# Altium project openEPS.PrjPcb (part 2 of 5)

## Sheet INA381A Overcurrent Protection.SchDoc: INA381A Overcurrent Protection
size Letter; SheetNumber: 21
Used 2 times, as channels U_INA381A Overcurrent Protection2, U_INA381A Overcurrent Protection1. Parts and nets are listed once, with the designators drawn on the sheet.
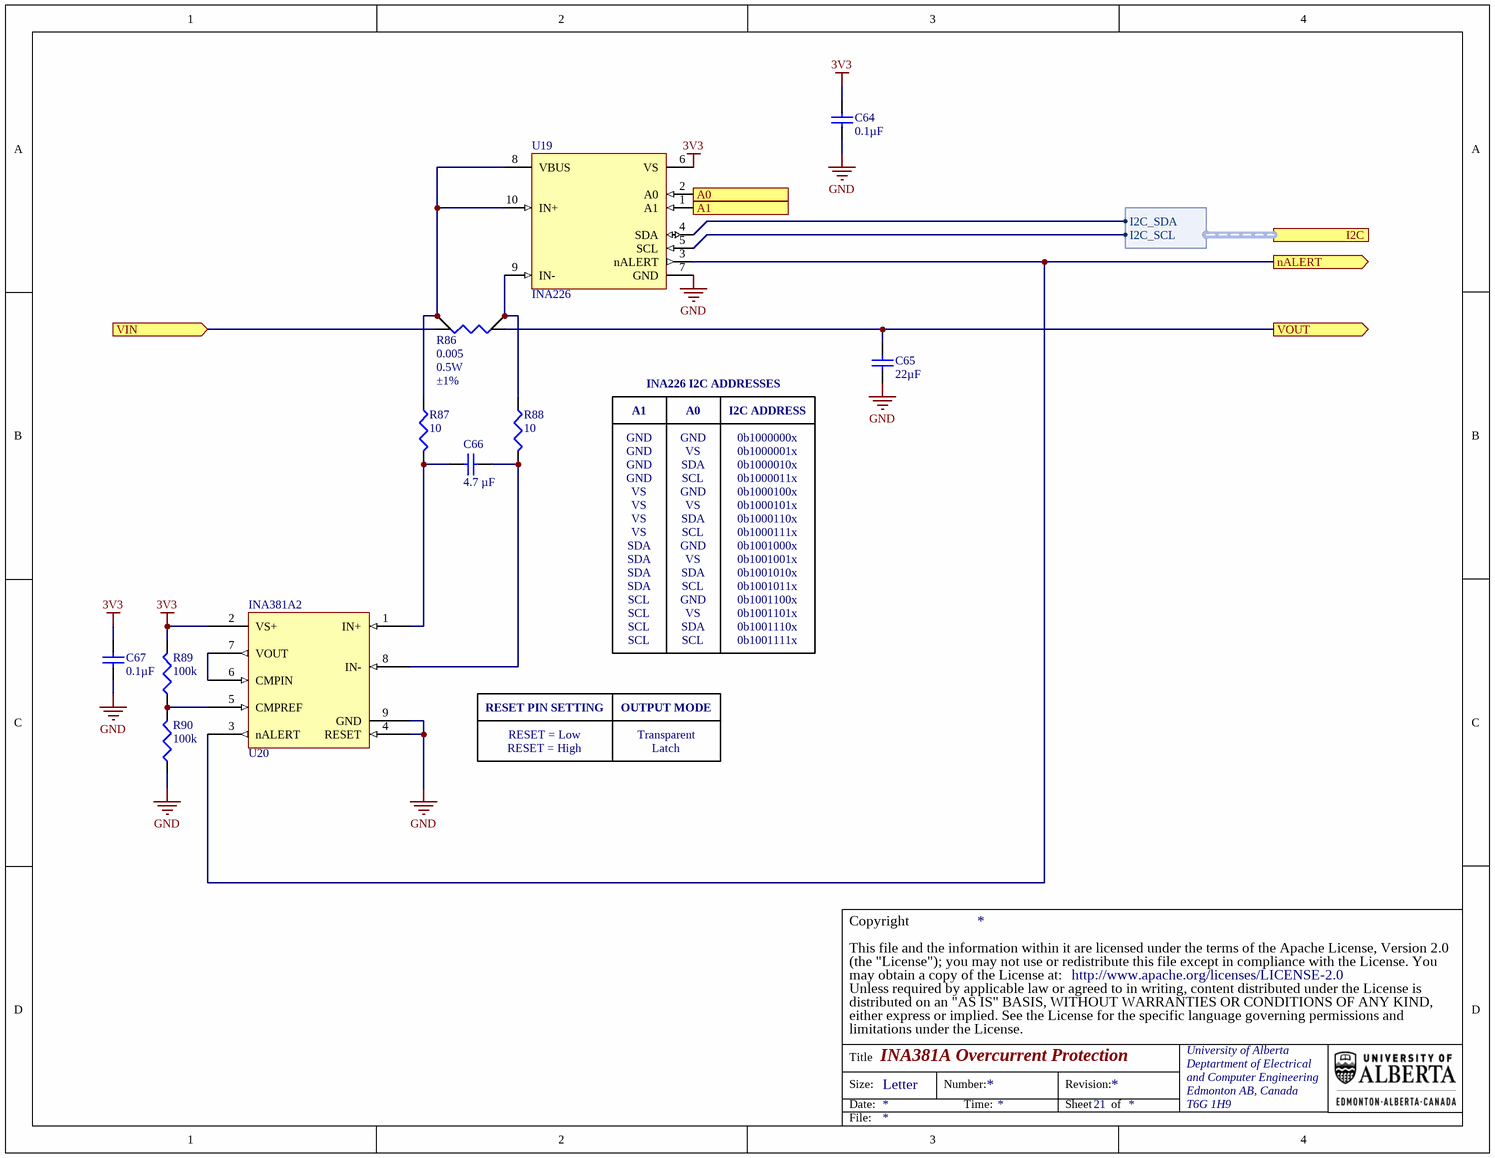
[diagram p5: INA381A Overcurrent Protection.SchDoc]

### Parts
C64  value 0.1µF  [TDK-CGA2B]  (hidden comment: Cap)
C65  value 22µF  [TY-1206L]  (hidden comment: Cap)
C66  value 4.7 µF  [MUR-GRM188]  (hidden comment: Cap)
C67  value 0.1µF  [TDK-CGA2B]  (hidden comment: Cap)
R86  value 0.005  Power - Rated: 0.5W  Tolerance: ±1%  [BRN-CRF0805]  (hidden comment: Res Sense)
R87  value 10  [PANA-ERA2A]  (hidden comment: Res3)
R88  value 10  [PANA-ERA2A]  (hidden comment: Res3)
R89  value 100k  [PANA-ERJ2R]  (hidden comment: Res3)
R90  value 100k  [PANA-ERJ2R]  (hidden comment: Res3)
U19  INA226  [TI-DGS]
U20  INA381A2  [TI-DSG0008A]

### Ports
A0 (in), A1 (in), I2C (harness INA226_I2C), nALERT (out), VIN (in), VOUT (out)

### Harnesses
INA226_I2C: I2C_SCL, I2C_SDA

### Nets
3V3: C64.2 C67.2 R89.2 U19.6(VS) U20.2(VS+)
GND: C64.1 C65.1 C67.1 R90.1 U19.7(GND) U20.4(RESET) U20.9(GND)
A0: U19.2(A0) ; port A0
A1: U19.1(A1) ; port A1
nALERT: U19.3(nALERT) U20.3(nALERT) ; port nALERT
VIN: R86.2(I2) ; port VIN
VOUT: C65.2 R86.1(I1) ; port VOUT
NetC66_1: C66.1 R88.2 U20.8(IN-)
NetC66_2: C66.2 R87.2 U20.1(IN+)
NetR86_3: R86.3(S2) R87.1 U19.8(VBUS) U19.10(IN+)
NetR86_4: R86.4(S1) R88.1 U19.9(IN-)
NetR89_1: R89.1 R90.2 U20.5(CMPREF)
NetU19_4: U19.4(SDA) ; port I2C.I2C_SDA
NetU19_5: U19.5(SCL) ; port I2C.I2C_SCL
NetU20_6: U20.6(CMPIN) U20.7(VOUT)

### Channels
U_INA381A Overcurrent Protection2: designators end in _1; ports A0=3V3 A1=3V3 nALERT=NetR52_1 VIN=1V2IN VOUT=1V2
U_INA381A Overcurrent Protection1: designators end in _2; ports A0=I2C0.I2C_SDA A1=3V3 nALERT=NetR52_1 VIN=3V3IN VOUT=3V3

### Notes on the sheet
- A1
- GND
- A0
- INA226 I2C ADDRESSES
- I2C ADDRESS
- 0b1000000x
- VS
- SDA
- SCL
- 0b1000001x
- 0b1000010x
- 0b1000011x
- 0b1000100x
- 0b1000101x
- 0b1000110x
- 0b1000111x
- 0b1001000x
- 0b1001001x
- 0b1001010x
- 0b1001011x
- 0b1001100x
- 0b1001101x
- 0b1001110x
- 0b1001111x
- RESET PIN SETTING
- OUTPUT MODE
- RESET = Low
- RESET = High
- Transparent
- Latch
- (the "License"); you may not use or redistribute this file except in compliance with the License. You
- This file and the information within it are licensed under the terms of the Apache License, Version 2.0
- Copyright
- Unless required by applicable law or agreed to in writing, content distributed under the License is
- distributed on an "AS IS" BASIS, WITHOUT WARRANTIES OR CONDITIONS OF ANY KIND,
- either express or implied. See the License for the specific language governing permissions and
- limitations under the License.
- may obtain a copy of the License at:
- http://www.apache.org/licenses/LICENSE-2.0
- Title
- Size:
- Date:
- Letter
- Number:
- Time:
- Revision:
- Sheet
- of
- University of Alberta
- Deptartment of Electrical
- and Computer Engineering
- Edmonton AB, Canada
- T6G 1H9
- File:

### Library data of the parts
C64 C67 = PC-TDK-02259: CAP CER 0.1UF 50V X7R 0402; Manufacturer Part Number: CGA2B3X7R1H104K050BB; Index: 2259; Designator: C?; Tolerance: ±10%; Published: 2016-03-16; LatestRevisionDate: 2016-03-16; LatestRevisionNote: ...; PackageReference: 0402 (1005 Metric); Publisher: AlbertaSat; PackageDescription: Radial Cap, Thru-Hole; 2 Leads; 0.3 in Pin Spacing; Part Number: PC-TDK-02259; Supplier Part Number 1: 445-6899-1-ND; Supplier 1: Digi-key; Supplier Link: http://www.digikey.ca/product-search/en?keywords=445-6899-1-ND; Voltage - Rated: 50V; Temperature Coefficient: X7R; Applications: Automotive; Operating Temperature: -55°C ~ 125°C
C65 = PC-TY-00721: CAP CER 22UF 16V X7R 1206; Manufacturer Part Number: EMK316BB7226ML-T; Index: 721; Designator: C?; Tolerance: ±20%; Published: 2016-03-13; LatestRevisionDate: 2016-03-13; LatestRevisionNote: ...; PackageReference: 1206 (3216 Metric); Publisher: AlbertaSat; PackageDescription: Chip Capacitor, 2-Leads, Body 3.20x1.60mm, IPC Low Density; Part Number: PC-TY-00721; Supplier Part Number 1: 587-4319-1-ND; Supplier 1: Digi-key; Supplier Link: http://www.digikey.ca/product-search/en?keywords=587-4319-1-ND; Voltage-Rated: 16V; Temperature Coefficient: X7R; Application: General Purpose; Operating Temperature: -55°C ~ 125°C
C66 = 10165: as C4 on sheet openEPS; Published: 8-Jun-2000; LatestRevisionDate: 17-Jul-2002; LatestRevisionNote: Re-released for DXP Platform.; PackageReference: 0603 (1608 Metric); Publisher: Altium Limited; PackageDescription: Chip Capacitor, 2-Leads, Body 1.60x0.80mm, IPC Low Density; Supplier Part Number 1: 490-GRM188Z71C475KE21DCT-ND; Supplier 1: Digi-Key; Supplier Link: #https://www.digikey.ca/en/products/detail/murata-electronics/GRM188Z71C475KE21D/13401930#; Temperature Coefficient: X7R; Application: General Purpose; Operating Temperature: -55°C ~ 125°C; Supplier 2: Mouser; Supplier Part Number 2: 81-GRM188Z71C475KE1D
R86 = PR-BRN-00023: RES 0.005 OHM 1% 1/2W 0805; Manufacturer Part Number: CRF0805-FZ-R005ELF; Index: 23; Designator: R?; Temperature Coefficient: ±50ppm/°C; Part Number: PR-BRN-00023; Supplier Part Number 1: CRF0805-FZ-R005ELFCT-ND; Supplier 1: Digi-key; Supplier Part Number 2: 652-CRF0805FZR005ELF; Supplier 2: Mouser; Publisher: AlbertaSat; Published: 2022-11-26; LatestRevisionDate: 2023-05-04; LatestRevisionNote: Added operating temperature; PackageReference: BRN-CRF0805; Supplier Link: #https://www.digikey.ca/en/products/detail/bourns-inc/CRF0805-FZ-R005ELF/6210977#; Operating Temperature: -55°C ~ 170°C
R87 R88 = 13235: RES SMD 10 OHM 0.5% 1/16W 0402; Part Number: 13235; Manufacturer Part Number: ERA-2AKD100X; Designator: R?; Power: 0.063W, 1/16W; Temperature Coefficient: ±100ppm/°C; Published: 8-Jun-2000; LatestRevisionDate: 29-May-2009; LatestRevisionNote: IPC-7351 Footprint Added.; PackageReference: 0402 (1005 Metric); Publisher: Altium Limited; PackageDescription: Chip Resistor, 2-Leads, Body 1.00x0.50mm, IPC Low Density; Supplier Part Number 1: P10DDCT-ND; Supplier 1: Digi-Key; Supplier Link: http://www.digikey.ca/product-search/en?keywords=P10DDCT-ND; Tolerance: ±0.5%; Operating Temperature: -55°C ~ 155°C
R89 R90 = 18739: RES SMD 100K OHM 1% 1/10W 0402; Part Number: 18739; Manufacturer Part Number: ERJ-2RKF1003X; Designator: R?; Power: 0.1W, 1/10W; Temperature Coefficient: ±100ppm/°C; Published: 8-Jun-2000; LatestRevisionDate: 29-May-2009; LatestRevisionNote: IPC-7351 Footprint Added.; PackageReference: 0402 (1005 Metric); Publisher: Altium Limited; PackageDescription: Chip Resistor, 2-Leads, Body 1.00x0.50mm, IPC Low Density; Supplier Part Number 1: P100KLCT-ND; Supplier 1: Digi-Key; Supplier Link: http://www.digikey.ca/product-search/en?keywords=P100KLCT-ND; Tolerance: ±1%; Operating Temperature: -55°C ~ 155°C
U19 = 19: IC MONITOR PWR/CURR BIDIR 10MSOP; Part Number: 19; Manufacturer Part Number: INA226AQDGSRQ1; Designator: U?; Supplier Part Number 2: 595-INA226AQDGSRQ1; Supplier 2: Mouser; Supplier Part Number 1: 296-42503-1-ND; Supplier 1: Digi-Key; Supplier Link: #https://www.digikey.com/product-detail/en/texas-instruments/INA226AQDGSRQ1/296-42503-1-ND/5416001#; PackageReference: TI-MSOP10; Operating Temperature: -40°C ~ 125°C
U20 = 110: CURRENT SENSE AMPLIFIER WITH INT; Part Number: 110; Manufacturer Part Number: INA381A2IDSGT; Designator: U?; Supplier Part Number 2: 595-INA381A2IDSGT; Supplier 2: Mouser; Supplier Part Number 1: 296-49078-1-ND; Supplier 1: Digi-Key; Supplier Link: #https://www.digikey.ca/product-detail/en/texas-instruments/INA381A2IDSGT/296-49078-1-ND/9091891#; PackageReference: 8-WFDFN Exposed Pad; Operating Temperature: -40°C ~ 125°C (TA)

## Sheet EPS Stack Header.SchDoc: EPS stack header
size Letter; SheetNumber: 20
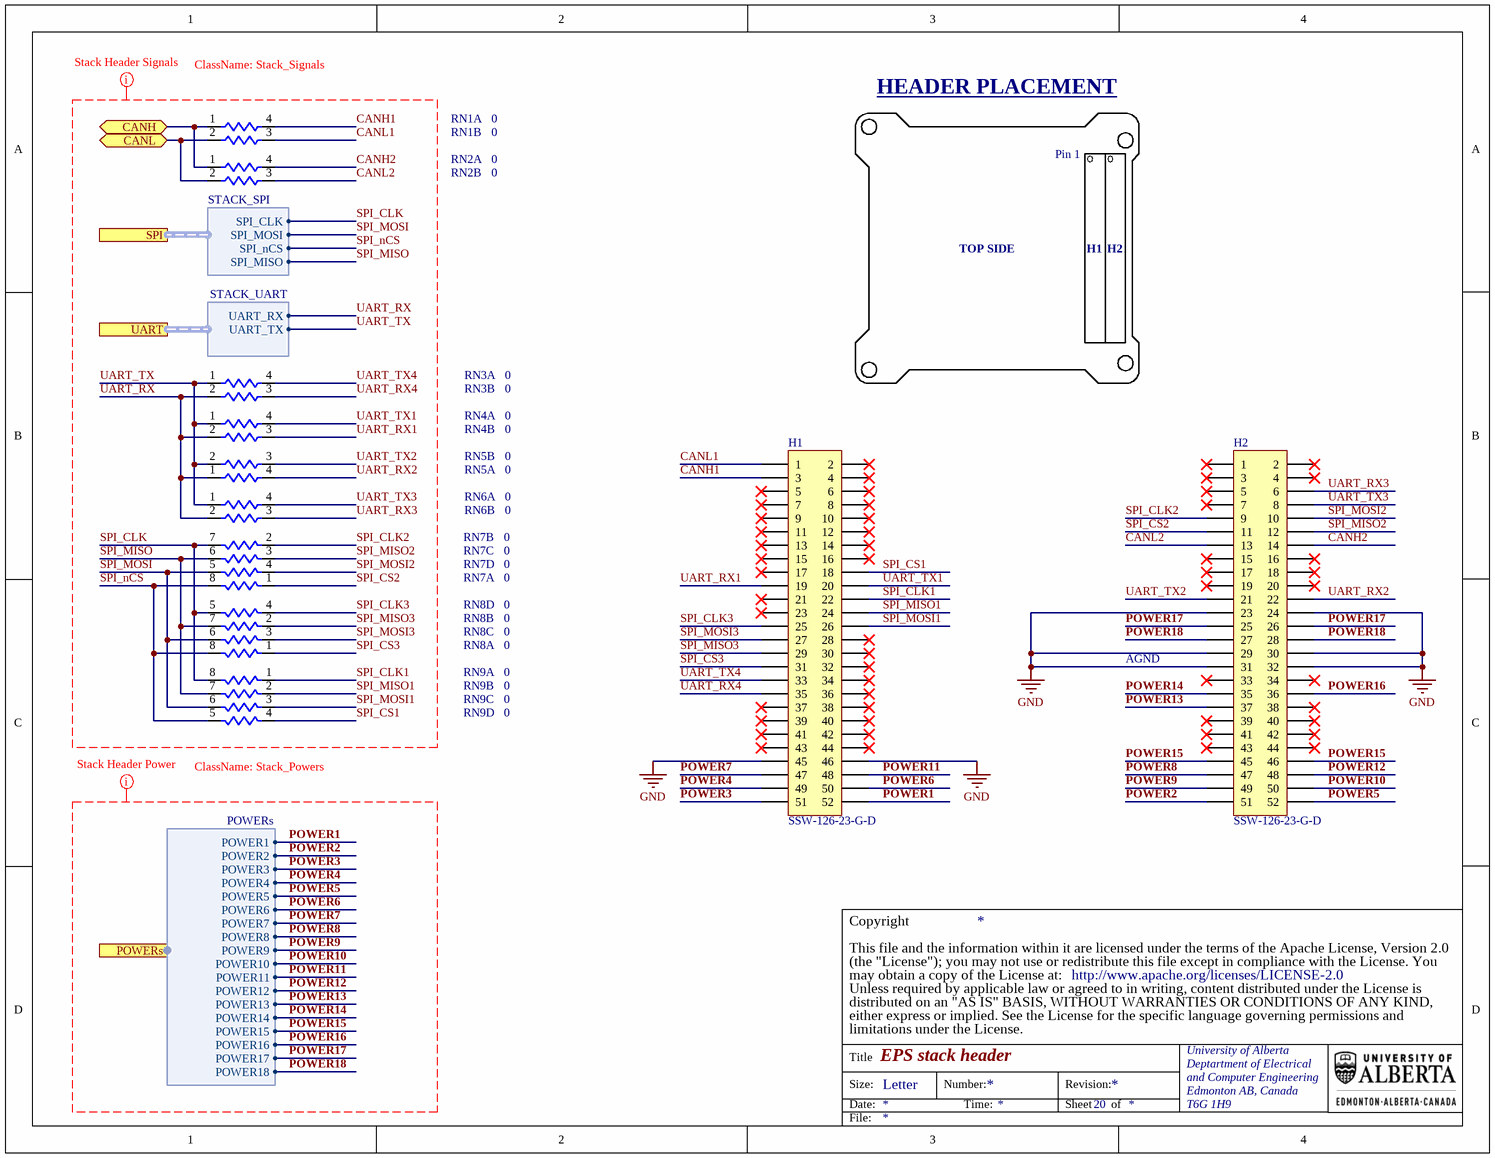
[diagram p6: EPS Stack Header.SchDoc]

### Parts
H1  SSW-126-23-G-D  [SSW-126-23-G-D]
H2  SSW-126-23-G-D  [SSW-126-23-G-D]
RN1  value 0  [PANA-EXB24V]  (hidden comment: Res2 Pack1)  (parts A,B of 2)
RN2  value 0  [PANA-EXB24V]  (hidden comment: Res2 Pack1)  (parts A,B of 2)
RN3  value 0  [PANA-EXB24V]  (hidden comment: Res2 Pack1)  (parts A,B of 2)
RN4  value 0  [PANA-EXB24V]  (hidden comment: Res2 Pack1)  (parts A,B of 2)
RN5  value 0  [PANA-EXB24V]  (hidden comment: Res2 Pack1)  (parts A,B of 2)
RN6  value 0  [PANA-EXB24V]  (hidden comment: Res2 Pack1)  (parts A,B of 2)
RN7  value 0  [PANA-EXB28V]  (hidden comment: Res4 Pack1)  (parts A,B,C,D of 4)
RN8  value 0  [PANA-EXB28V]  (hidden comment: Res4 Pack1)  (parts A,B,C,D of 4)
RN9  value 0  [PANA-EXB28V]  (hidden comment: Res4 Pack1)  (parts A,B,C,D of 4)

### Ports
CANH (bidir), CANL (bidir), POWERs (harness POWERs), SPI (harness STACK_SPI), UART (harness STACK_UART)

### Harnesses
STACK_SPI: SPI_MOSI, SPI_MISO, SPI_CLK, SPI_nCS
STACK_UART: UART_RX, UART_TX
POWERs: POWER1, POWER2, POWER3, POWER4, POWER5, POWER6, POWER7, POWER8, POWER9, POWER10, POWER11, POWER12, POWER13, POWER14, POWER15, POWER16, POWER17, POWER18

### Nets
GND: H1.45 H1.46 H2.23 H2.24 H2.29 H2.30 H2.31 H2.32
CAN_N: RN1.2 RN2.2 ; port CANL
CAN_P: RN1.1 RN2.1 ; port CANH
CANH1: H1.3 RN1.4
CANH2: H2.14 RN2.4
CANL1: H1.1 RN1.3
CANL2: H2.13 RN2.3
POWER1: H1.52 ; port POWERs.POWER1
POWER2: H2.51 ; port POWERs.POWER2
POWER3: H1.51 ; port POWERs.POWER3
POWER4: H1.49 ; port POWERs.POWER4
POWER5: H2.52 ; port POWERs.POWER5
POWER6: H1.50 ; port POWERs.POWER6
POWER7: H1.47 ; port POWERs.POWER7
POWER8: H2.47 ; port POWERs.POWER8
POWER9: H2.49 ; port POWERs.POWER9
POWER10: H2.50 ; port POWERs.POWER10
POWER11: H1.48 ; port POWERs.POWER11
POWER12: H2.48 ; port POWERs.POWER12
POWER13: H2.37 ; port POWERs.POWER13
POWER14: H2.35 ; port POWERs.POWER14
POWER15: H2.45 H2.46 ; port POWERs.POWER15
POWER16: H2.36 ; port POWERs.POWER16
POWER17: H2.25 H2.26 ; port POWERs.POWER17
POWER18: H2.27 H2.28 ; port POWERs.POWER18
SPI_CLK: RN7.7 RN8.5 RN9.8 ; port SPI.SPI_CLK  [project net SPI1_CLK]
SPI_CLK1: H1.22 RN9.1
SPI_CLK2: H2.9 RN7.2
SPI_CLK3: H1.25 RN8.4
SPI_CS1: H1.18 RN9.4
SPI_CS2: H2.11 RN7.1
SPI_CS3: H1.31 RN8.1
SPI_MISO: RN7.6 RN8.7 RN9.7 ; port SPI.SPI_MISO  [project net SPI1_MISO]
SPI_MISO1: H1.24 RN9.2
SPI_MISO2: H2.12 RN7.3
SPI_MISO3: H1.29 RN8.2
SPI_MOSI: RN7.5 RN8.6 RN9.6 ; port SPI.SPI_MOSI  [project net SPI1_MOSI]
SPI_MOSI1: H1.26 RN9.3
SPI_MOSI2: H2.10 RN7.4
SPI_MOSI3: H1.27 RN8.3
SPI_nCS: RN7.8 RN8.8 RN9.5 ; port SPI.SPI_nCS  [project net SPI1_nCS]
UART_RX: RN3.2 RN4.2 RN5.1 RN6.2 ; port UART.UART_RX  [project net UART1_RX]
UART_RX1: H1.19 RN4.3
UART_RX2: H2.22 RN5.4
UART_RX3: H2.6 RN6.3
UART_RX4: H1.35 RN3.3
UART_TX: RN3.1 RN4.1 RN5.2 RN6.1 ; port UART.UART_TX  [project net UART1_TX]
UART_TX1: H1.20 RN4.4
UART_TX2: H2.21 RN5.3
UART_TX3: H2.8 RN6.4
UART_TX4: H1.33 RN3.4

Not connected (* = marked no-connect by the designer): H1 2* 4* 5* 6* 7* 8* 9* 10* 11* 12* 13* 14* 15* 16* 17* 21* 23* 28* 30* 32* 34* 36* 37* 38* 39* 40* 41* 42* 43* 44*; H2 1* 2* 3* 4* 5* 7* 15* 16* 17* 18* 19* 20* 33* 34* 38* 39* 40* 41* 42* 43* 44*

### Layout directives
net class Stack_Signals: CANH1, CANH2, CANL1, CANL2, SPI_CLK, SPI_CLK1, SPI_CLK2, SPI_CLK3, SPI_CS1, SPI_CS2, SPI_CS3, SPI_MISO, SPI_MISO1, SPI_MISO2, SPI_MISO3, SPI_MOSI, SPI_MOSI1, SPI_MOSI2, SPI_MOSI3, SPI_nCS, UART_RX, UART_RX1, UART_RX2, UART_RX3, UART_RX4, UART_TX, UART_TX1, UART_TX2, UART_TX3, UART_TX4
net class Stack_Powers: POWER1, POWER2, POWER3, POWER4, POWER5, POWER6, POWER7, POWER8, POWER9, POWER10, POWER11, POWER12, POWER13, POWER14, POWER15, POWER16, POWER17, POWER18

### Notes on the sheet
- HEADER PLACEMENT
- Pin 1
- TOP SIDE
- H1
- H2
- AGND
- (the "License"); you may not use or redistribute this file except in compliance with the License. You
- This file and the information within it are licensed under the terms of the Apache License, Version 2.0
- Copyright
- Unless required by applicable law or agreed to in writing, content distributed under the License is
- distributed on an "AS IS" BASIS, WITHOUT WARRANTIES OR CONDITIONS OF ANY KIND,
- either express or implied. See the License for the specific language governing permissions and
- limitations under the License.
- may obtain a copy of the License at:
- http://www.apache.org/licenses/LICENSE-2.0
- Title
- Size:
- Date:
- Letter
- Number:
- Time:
- Revision:
- Sheet
- of
- University of Alberta
- Deptartment of Electrical
- and Computer Engineering
- Edmonton AB, Canada
- T6G 1H9
- File:

### Library data of the parts
H1 H2 = PP-SAM-00002: Index: 3; Designator: P?; Part Number: PP-SAM-00002; Manufacturer Part Number: SSW-126-23-G-D; Supplier Part Number 1: SSW-126-23-G-D; Supplier 1: Samtec; Publisher: AlbertaSat; Published: 2018-06-07; LatestRevisionDate: 2018-06-07; LatestRevisionNote: ...; Supplier Link: #https://www.samtec.com/products/ssw-126-23-g-d#; Operating Temperature: -55°C ~ 125°C
RN1-RN6 = 20039: RES ARRAY 2 RES ZERO OHM 0404; Part Number: 20039; Manufacturer Part Number: EXB-24VR000X; Sim Note: Enter the Resistance value into parameter field.; Designator: RN?; Tolerance: Jumper; Power: 62.5mW; Code_JEDEC: MS-012-AC; Supplier Part Number 1: Y5000CT-ND; Supplier 1: Digi-Key; Supplier Link: #https://www.digikey.ca/en/products/detail/panasonic-electronic-components/EXB-24VR000X/524613#; PackageReference: 0404 (1010 Metric), Convex; PackageDescription: Chip Array, Flat, 4-Leads, Pitch 0.65mm,  Body 1.00x1.00mm,  IPC Low Density; Type: Jumper; Operating Temperature: -55°C ~ 125°C; Supplier 2: Mouser; Supplier Part Number 2: 667-EXB-24VR000X
RN7-RN9 = 19874: RES ARRAY 4 RES ZERO OHM 0804; Part Number: 19874; Manufacturer Part Number: EXB-28VR000X; Sim Note: Enter the Resistance value into parameter field.; Designator: RN?; Tolerance: Jumper; Power: 62.5mW; Code_JEDEC: MS-012-AC; Supplier Part Number 1: Y7000CT-ND; Supplier 1: Digi-Key; Supplier Link: http://www.digikey.ca/product-search/en?keywords=Y7000CT-ND; PackageReference: 0804, Convex, Long Side Terminals; Temperature Coefficient: -; Type: Jumper; Operating Temperature: -55°C ~ 125°C

## Sheet AD5324 Digital-to-Analog Converter.SchDoc: AD5324 Digital-to-Analog Converter
size Letter; SheetNumber: 12
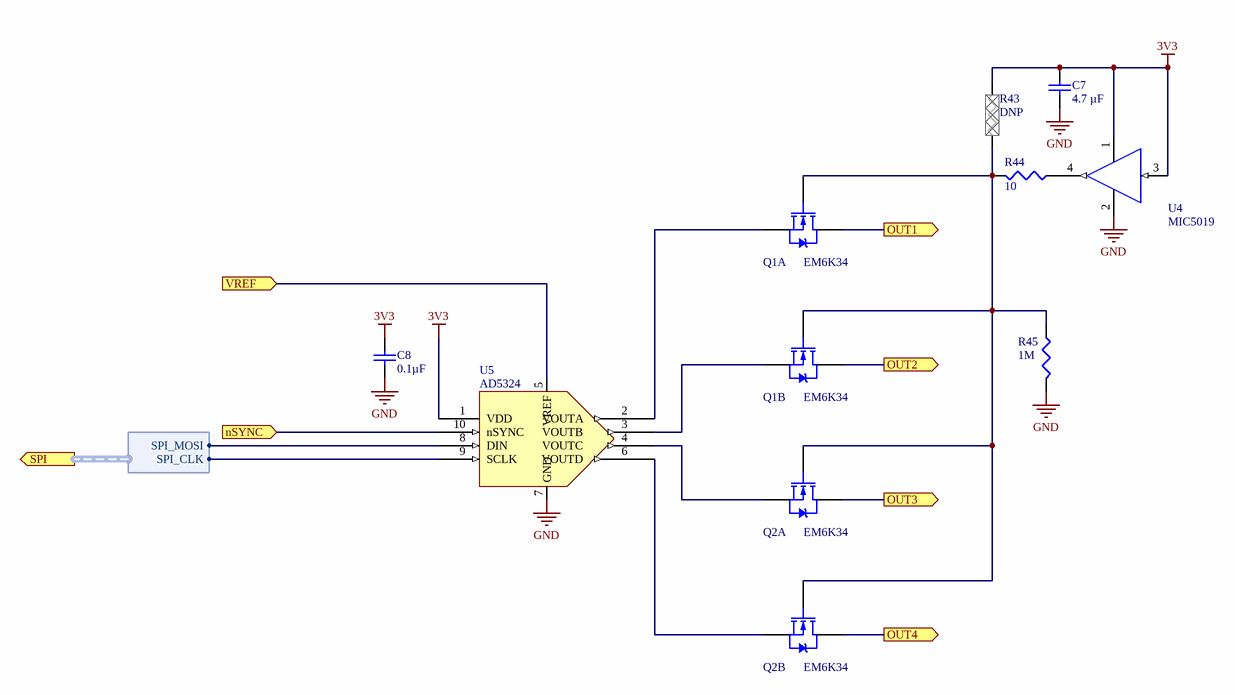
[diagram p7: AD5324 Digital-to-Analog Converter.SchDoc]

### Parts
C7  value 4.7 µF  [MUR-GRM188]  (hidden comment: Cap)
C8  value 0.1µF  [TDK-CGA2B]  (hidden comment: Cap)
Q1  EM6K34  [ROH-EMT6]  (parts A,B of 2)
Q2  EM6K34  [ROH-EMT6]  (parts A,B of 2)
R43  DNP  [PANA-ERA2A]  (no BOM)
R44  value 10  [PANA-ERA2A]  (hidden comment: Res3)
R45  value 1M  [PANA-ERJ2R]  (hidden comment: Res3)
U4  MIC5019  [MCP-MIC5019]
U5  AD5324  [ADI-RM-10]

### Ports
nSYNC (in), OUT1 (out), OUT2 (out), OUT3 (out), OUT4 (out), SPI (out, harness AD5324_SPI), VREF (in)

### Harnesses
AD5324_SPI: SPI_MOSI, SPI_CLK

### Nets
3V3: C7.2 C8.1 R43.2 U4.1(VDD) U4.3(IN) U5.1(VDD)
GND: C7.1 C8.2 R45.1 U4.2(GND) U5.7(GND)
VREF(1.6V): U5.5(VREF) ; port VREF
GIO26: U5.10(nSYNC) ; port nSYNC
SPI3_CLK: U5.8(DIN) ; port SPI.SPI_MOSI
SPI3_MOSI: U5.9(SCLK) ; port SPI.SPI_CLK
NetQ1_1: Q1.1(G1) Q1.4(G2) Q2.1(G1) Q2.4(G2) R43.1 R44.2 R45.2
NetQ1_2: Q1.2(S1) U5.2(VOUTA)
NetQ1_3: Q1.3(D2) ; port OUT2
NetQ1_5: Q1.5(S2) U5.3(VOUTB)
NetQ1_6: Q1.6(D1) ; port OUT1
NetQ2_2: Q2.2(S1) U5.4(VOUTC)
NetQ2_3: Q2.3(D2) ; port OUT4
NetQ2_5: Q2.5(S2) U5.6(VOUTD)
NetQ2_6: Q2.6(D1) ; port OUT3
NetR44_1: R44.1 U4.4(OUT)

### Notes on the sheet
- (the "License"); you may not use or redistribute this file except in compliance with the License. You
- This file and the information within it are licensed under the terms of the Apache License, Version 2.0
- Copyright
- Unless required by applicable law or agreed to in writing, content distributed under the License is
- distributed on an "AS IS" BASIS, WITHOUT WARRANTIES OR CONDITIONS OF ANY KIND,
- either express or implied. See the License for the specific language governing permissions and
- limitations under the License.
- may obtain a copy of the License at:
- http://www.apache.org/licenses/LICENSE-2.0
- Title
- Size:
- Date:
- Letter
- Number:
- Time:
- Revision:
- Sheet
- of
- University of Alberta
- Deptartment of Electrical
- and Computer Engineering
- Edmonton AB, Canada
- T6G 1H9
- File:

### Library data of the parts
C7 = 10165: as C4 on sheet openEPS; Published: 8-Jun-2000; LatestRevisionDate: 17-Jul-2002; LatestRevisionNote: Re-released for DXP Platform.; PackageReference: 0603 (1608 Metric); Publisher: Altium Limited; PackageDescription: Chip Capacitor, 2-Leads, Body 1.60x0.80mm, IPC Low Density; Supplier Part Number 1: 490-GRM188Z71C475KE21DCT-ND; Supplier 1: Digi-Key; Supplier Link: #https://www.digikey.ca/en/products/detail/murata-electronics/GRM188Z71C475KE21D/13401930#; Temperature Coefficient: X7R; Application: General Purpose; Operating Temperature: -55°C ~ 125°C; Supplier 2: Mouser; Supplier Part Number 2: 81-GRM188Z71C475KE1D
C8 = PC-TDK-02259: as C64 on sheet INA381A Overcurrent Protection; Published: 2016-03-16; LatestRevisionDate: 2016-03-16; LatestRevisionNote: ...; PackageReference: 0402 (1005 Metric); Publisher: AlbertaSat; PackageDescription: Radial Cap, Thru-Hole; 2 Leads; 0.3 in Pin Spacing; Part Number: PC-TDK-02259; Supplier Part Number 1: 445-6899-1-ND; Supplier 1: Digi-key; Supplier Link: http://www.digikey.ca/product-search/en?keywords=445-6899-1-ND; Voltage - Rated: 50V; Temperature Coefficient: X7R; Applications: Automotive; Operating Temperature: -55°C ~ 125°C
Q1 Q2 = PQ-ROH-00008: MOSFET 2N-CH 50V 0.2A EMT6; Index: 8; Designator: Q?; Power - Max: 120mW; Rds On (Max): 2.2Ohm @ 200mA, 4.5V; Vgs(th) (Max): 800mV @ 1mA; Part Number: PQ-ROH-00008; Manufacturer Part Number: EM6K34T2CR; Supplier Part Number 1: EM6K34T2CRCT-ND; Supplier 1: Digi-key; Supplier Part Number 2: 755-EM6K34T2CR; Supplier 2: Mouser; Publisher: AlbertaSat; Published: 2023-04-17; LatestRevisionDate: 2023-04-17; LatestRevisionNote: ...; PackageReference: SOT-563, SOT-666; PackageDescription: SOTFL, 6-Leads, Body 1.60x1.60mm, Pitch 0.50mm, IPC Medium Density; Supplier Link: #https://www.digikey.ca/en/products/detail/rohm-semiconductor/EM6K34T2CR/5042498#; Operating Temperature: -55°C ~ 150°C (TJ)
R43 = 19768: Part Number: 19768; Designator: R?; Value: DNP; PackageReference: 0402 (1005 Metric); PackageDescription: Chip Resistor, 2-Leads, Body 1.00x0.50mm, IPC Low Density
R44 = 13235: as R87 on sheet INA381A Overcurrent Protection; Published: 8-Jun-2000; LatestRevisionDate: 29-May-2009; LatestRevisionNote: IPC-7351 Footprint Added.; PackageReference: 0402 (1005 Metric); Publisher: Altium Limited; PackageDescription: Chip Resistor, 2-Leads, Body 1.00x0.50mm, IPC Low Density; Supplier Part Number 1: P10DDCT-ND; Supplier 1: Digi-Key; Supplier Link: http://www.digikey.ca/product-search/en?keywords=P10DDCT-ND; Tolerance: ±0.5%; Operating Temperature: -55°C ~ 155°C
R45 = 19704: RES SMD 1M OHM 1% 1/10W 0402; Part Number: 19704; Manufacturer Part Number: ERJ-2RKF1004X; Designator: R?; Power: 0.1W, 1/10W; Temperature Coefficient: ±100ppm/°C; Published: 8-Jun-2000; LatestRevisionDate: 29-May-2009; LatestRevisionNote: IPC-7351 Footprint Added.; PackageReference: 0402 (1005 Metric); Publisher: Altium Limited; PackageDescription: Chip Resistor, 2-Leads, Body 1.00x0.50mm, IPC Low Density; Supplier Part Number 1: P1.00MLCT-ND; Supplier 1: Digi-Key; Supplier Link: http://www.digikey.ca/product-search/en?keywords=P1.00MLCT-ND; Tolerance: ±1%; Operating Temperature: -55°C ~ 155°C
U4 = PU-MCP-00008: IC GATE DRVR HIGH-SIDE 4TQFN; Index: 8; Designator: U?; Part Number: PU-MCP-00008; Manufacturer Part Number: MIC5019YFT-TR; Supplier Part Number 1: 576-4152-1-ND; Supplier 1: Digi-key; Supplier Part Number 2: 998-MIC5019YFTTR; Supplier 2: Mouser; Publisher: AlbertaSat; Published: 2020-04-01; LatestRevisionDate: 2020-04-01; LatestRevisionNote: ...; PackageReference: 4-TQFN (1.2x1.2); Supplier Link: #https://www.digikey.ca/en/products/detail/microchip-technology/MIC5019YFT-TR/3681038#; Operating Temperature: -40°C ~ 125°C (TJ)
U5 = PU-ADI-00016: IC DAC 12BIT V-OUT 10MSOP; Index: 16; Designator: U?; Part Number: PU-ADI-00016; Manufacturer Part Number: AD5324BRMZ; Supplier Part Number 1: 505-AD5324BRMZ-ND; Supplier 1: Digi-key; Supplier Part Number 2: 584-AD5324BRMZ; Supplier 2: Mouser; Publisher: AlbertaSat; Published: 2023-05-04; LatestRevisionDate: 2023-05-04; LatestRevisionNote: ...; PackageReference: 10-MSOP; PackageDescription: TSSOP, 10-Leads, Body 3.00x3.00mm, Pitch 0.50mm, IPC Low Density; Supplier Link: #https://www.digikey.ca/en/products/detail/analog-devices-inc/AD5324BRMZ/653863#; Operating Temperature: -40°C ~ 105°C

## Sheet TPS53319 1.2V Buck Converter.SchDoc
size Letter; Organization: Altium Limited; Address1: L3, 12a Rodborough Rd; Address2: Frenchs Forest; Address3: NSW; Address4: Australia 2086; CopyrightYear: 2019
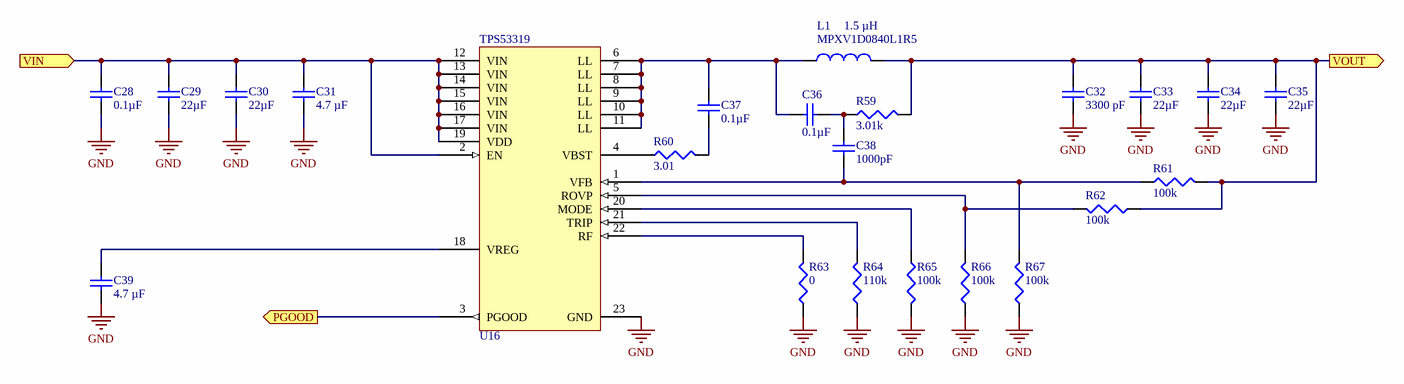
[diagram p8: TPS53319 1.2V Buck Converter.SchDoc]

### Parts
C28  value 0.1µF  [TY-TWK107]  (hidden comment: Cap)
C29  value 22µF  [TDK-C3225]  (hidden comment: Cap)
C30  value 22µF  [TDK-C3225]  (hidden comment: Cap)
C31  value 4.7 µF  [MUR-GRM188]  (hidden comment: Cap)
C32  value 3300 pF  [KEM-0402BB]  (hidden comment: Cap)
C33  value 22µF  [TDK-C3225]  (hidden comment: Cap)
C34  value 22µF  [TDK-C3225]  (hidden comment: Cap)
C35  value 22µF  [TDK-C3225]  (hidden comment: Cap)
C36  value 0.1µF  [TY-TWK107]  (hidden comment: Cap)
C37  value 0.1µF  [TY-TWK107]  (hidden comment: Cap)
C38  value 1000pF  [TDK-CGA2B]  (hidden comment: Cap)
C39  value 4.7 µF  [MUR-GRM188]  (hidden comment: Cap)
L1  value 1.5 µH  Manufacturer Part Number: MPXV1D0840L1R5  [KEM-MPXV1D0840]  (hidden comment: Inductor)
R59  value 3.01k  [VSH-CRCW0201]  (hidden comment: Res3)
R60  value 3.01  [VSH-CRCW0201]  (hidden comment: Res3)
R61  value 100k  [PANA-ERJ2R]  (hidden comment: Res3)
R62  value 100k  [PANA-ERJ2R]  (hidden comment: Res3)
R63  value 0  [PANA-ERJ2G]  (hidden comment: Jumper)
R64  value 110k  [PANA-ERJ2R]  (hidden comment: Res3)
R65  value 100k  [PANA-ERJ2R]  (hidden comment: Res3)
R66  value 100k  [PANA-ERJ2R]  (hidden comment: Res3)
R67  value 100k  [PANA-ERJ2R]  (hidden comment: Res3)
U16  TPS53319  [TI-R-PSON-N22]

### Ports
PGOOD (out), VIN (in), VOUT (out)

### Nets
GND: C28.1 C29.1 C30.1 C31.1 C32.1 C33.1 C34.1 C35.1 C39.1 R63.1 R64.1 R65.1 R66.1 R67.1 U16.23(GND)
VBATT_BUS: C28.2 C29.2 C30.2 C31.2 U16.2(EN) U16.12(VIN) U16.13(VIN) U16.14(VIN) U16.15(VIN) U16.16(VIN) U16.17(VIN) U16.19(VDD) ; port VIN
NetC32_2: C32.2 C33.2 C34.2 C35.2 L1.2 R59.2 R61.2 R62.1 ; port VOUT
NetC36_1: C36.1 C38.1 R59.1
NetC36_2: C36.2 C37.2 L1.1 U16.6(LL) U16.7(LL) U16.8(LL) U16.9(LL) U16.10(LL) U16.11(LL)
NetC37_1: C37.1 R60.2
NetC38_2: C38.2 R61.1 R67.2 U16.1(VFB)
NetC39_2: C39.2 U16.18(VREG)
NetR52_1: U16.3(PGOOD) ; port PGOOD
NetR60_1: R60.1 U16.4(VBST)
NetR62_2: R62.2 R66.2 U16.5(ROVP)
NetR63_2: R63.2 U16.22(RF)
NetR64_2: R64.2 U16.21(TRIP)
NetR65_2: R65.2 U16.20(MODE)

### Notes on the sheet
- (the "License"); you may not use or redistribute this file except in compliance with the License. You
- This file and the information within it are licensed under the terms of the Apache License, Version 2.0
- Copyright
- Unless required by applicable law or agreed to in writing, content distributed under the License is
- distributed on an "AS IS" BASIS, WITHOUT WARRANTIES OR CONDITIONS OF ANY KIND,
- either express or implied. See the License for the specific language governing permissions and
- limitations under the License.
- may obtain a copy of the License at:
- http://www.apache.org/licenses/LICENSE-2.0
- Title
- Size:
- Date:
- Letter
- Number:
- Time:
- Revision:
- Sheet
- of
- University of Alberta
- Deptartment of Electrical
- and Computer Engineering
- Edmonton AB, Canada
- T6G 1H9
- File:

### Library data of the parts
C28 C36 C37 = PC-TY-00817: CAP CER 0.1UF 25V X7R 0306; Manufacturer Part Number: TWK107B7104MVHT; Index: 817; Designator: C?; Tolerance: ±20%; Published: 2022-12-10; LatestRevisionDate: 2022-12-10; LatestRevisionNote: ...; PackageReference: 0306 (0816 Metric); Publisher: AlbertaSat; PackageDescription: Chip Capacitor, 2-Leads, Body 0.80x1.60mm, IPC Low Density; Part Number: PC-TY-00817; Supplier Part Number 1: 587-6181-1-ND; Supplier 1: Digi-key; Supplier Part Number 2: 963-TWK107B7104MVHT; Supplier 2: Mouser; Supplier Link: #https://www.digikey.ca/en/products/detail/taiyo-yuden/TWK107B7104MVHT/7403736#; Voltage-Rated: 25V; Temperature Coefficient: X7R; Application: Automotive; Operating Temperature: -55°C ~ 125°C
C29 C30 C33-C35 = PC-TDK-02965: CAP CER 22UF 25V X7R 1210; Manufacturer Part Number: C3225X7R1E226M250AB; Index: 2965; Designator: C?; Tolerance: ±20%; Code_IEC: 3225; Published: 2022-10-26; LatestRevisionDate: 2022-10-26; LatestRevisionNote: ...; PackageReference: 1210 (3225 Metric); Publisher: AlbertaSat; PackageDescription: Chip Capacitor, 2-Leads, Body 3.20x2.50mm, IPC Low Density; Part Number: PC-TDK-02965; Supplier Part Number 1: 445-181602-1-ND; Supplier 1: Digi-key; Supplier Part Number 2: 810-C3225X7R1EM250AB; Supplier 2: Mouser; Supplier Link: #https://www.digikey.ca/en/products/detail/tdk-corporation/C3225X7R1E226M250AB/9991387#; Voltage - Rated: 25V; Temperature Coefficient: X7R; Applications: General Purpose; Code_JEITA: 1210; Operating Temperature: -55°C ~ 125°C
C31 C39 = 10165: as C4 on sheet openEPS; Published: 8-Jun-2000; LatestRevisionDate: 17-Jul-2002; LatestRevisionNote: Re-released for DXP Platform.; PackageReference: 0603 (1608 Metric); Publisher: Altium Limited; PackageDescription: Chip Capacitor, 2-Leads, Body 1.60x0.80mm, IPC Low Density; Supplier Part Number 1: 490-GRM188Z71C475KE21DCT-ND; Supplier 1: Digi-Key; Supplier Link: #https://www.digikey.ca/en/products/detail/murata-electronics/GRM188Z71C475KE21D/13401930#; Temperature Coefficient: X7R; Application: General Purpose; Operating Temperature: -55°C ~ 125°C; Supplier 2: Mouser; Supplier Part Number 2: 81-GRM188Z71C475KE1D
C32 = PC-KEM-03166: CAP CER 3300PF 50V X7R 0402; Manufacturer Part Number: C0402C332K5RAC7867; Index: 3166; Designator: C?; Tolerance: ±10%; Published: 2022-10-26; LatestRevisionDate: 2023-05-04; LatestRevisionNote: Added operating temperature; PackageReference: 0402 (1005 Metric); Publisher: AlbertaSat; PackageDescription: Chip Capacitor, 2-Leads, Body 1.00x0.50mm, IPC Low Density; Part Number: PC-KEM-03166; Supplier Part Number 1: 399-C0402C332K5RAC7867CT-ND; Supplier 1: Digi-key; Supplier Part Number 2: 80-C0402C332K5RAC; Supplier 2: Mouser; Supplier Link: #https://www.digikey.ca/en/products/detail/kemet/C0402C332K5RAC7867/501972?s=N4IgTCBcDaIMwE4EFoDCAGALOsq5zAGkBWAJQEFUB2ADgDYrUAVZAOQBEQBdAXyA#; Voltage - Rated: 50V; Temperature Coefficient: X7R; Applications: Bypass, Decoupling; Operating Temperature: -55°C ~ 125°C
C38 = PC-TDK-01454: CAP CER 1000PF 100V C0G 0402; Manufacturer Part Number: CGA2B1C0G2A102J050BC; Index: 1454; Designator: C?; Tolerance: ±5%; Temperature Coefficient: NP0; Published: 2016-03-16; LatestRevisionDate: 2016-03-16; LatestRevisionNote: ...; PackageReference: 0402 (1005 Metric); Publisher: AlbertaSat; PackageDescription: Radial Cap, Thru-Hole; 2 Leads; 0.3 in Pin Spacing; Part Number: PC-TDK-01454; Supplier Part Number 1: 445-172682-1-ND; Supplier 1: Digi-key; Supplier Link: http://www.digikey.ca/product-search/en?keywords=445-172682-1-ND; Voltage - Rated: 100V; Applications: Automotive; Operating Temperature: -55°C ~ 125°C
L1 = PL-KEM-03165: FIXED IND 1.5UH 16.2A 6.8MOHM SM; Code_IEC: 1005; Index: 3165; Designator: L?; Tolerance: ±20%; Published: 2022-10-26; LatestRevisionDate: 2023-05-04; LatestRevisionNote: Added operating temperature; PackageReference: 0.341" L x 0.315" W (8.65mm x 8.00mm); Publisher: AlbertaSat; PackageDescription: Precision Wire Wound Inductor, 2-Leads, Body 8.65x8.00mm, IPC Low Density; Code_JEITA: 0402; Part Number: PL-KEM-03165; Supplier Part Number 1: 399-MPXV1D0840L1R5CT-ND; Supplier 1: Digi-key; Supplier Part Number 2: 80-MPXV1D0840L1R5; Supplier 2: Mouser; Supplier Link: #https://www.digikey.ca/en/products/detail/kemet/MPXV1D0840L1R5/11314594?s=N4IgTCBcDaILIAUAaA1AjAEQAwA4AsWAMmgEoCsIAugL5A#; Operating Temperature: -55°C ~ 155°C
R59 = PR-VSH-00325: RES SMD 3.01K OHM 1% 1/20W 0201; Manufacturer Part Number: CRCW02013K01FKED; Index: 325; Designator: R?; Power - Rated: 0.05W, 1/20W; Temperature Coefficient: ±100ppm/°C; Published: 2022-12-11; LatestRevisionDate: 2022-12-11; LatestRevisionNote: ...; PackageReference: 0201 (0603 Metric); Publisher: AlbertaSat; PackageDescription: Chip Resistor, 2-Leads, Body 0.60x0.30mm, IPC Low Density; Part Number: PR-VSH-00325; Supplier Part Number 1: 541-3.01KAABCT-ND; Supplier 1: Digi-key; Supplier Part Number 2: 71-CRCW02013K01FKED; Supplier 2: Mouser; Supplier Link: #https://www.digikey.ca/en/products/detail/vishay-dale/CRCW02013K01FKED/1968056#; Tolerance: ±1%; Operating Temperature: -55°C ~ 155°C
R60 = PR-VSH-00326: CRCW0201 - 200/+400 3R01 1% ET7; Manufacturer Part Number: CRCW02013R01FXED; Index: 326; Designator: R?; Power - Rated: 0.05W, 1/20W; Temperature Coefficient: -200/ +400ppm/°C; Published: 2022-12-11; LatestRevisionDate: 2022-12-11; LatestRevisionNote: ...; PackageReference: 0201 (0603 Metric); Publisher: AlbertaSat; PackageDescription: Chip Resistor, 2-Leads, Body 0.60x0.30mm, IPC Low Density; Part Number: PR-VSH-00326; Supplier Part Number 1: 541-CRCW02013R01FXEDCT-ND; Supplier 1: Digi-key; Supplier Part Number 2: CRCW02013R01FXED; Supplier 2: Avnet; Supplier Link: #https://www.digikey.ca/en/products/detail/vishay-dale/CRCW02013R01FXED/10458991#; Tolerance: ±1%; Operating Temperature: -55°C ~ 155°C
R61 R62 R65-R67 = 18739: as R89 on sheet INA381A Overcurrent Protection; Published: 8-Jun-2000; LatestRevisionDate: 29-May-2009; LatestRevisionNote: IPC-7351 Footprint Added.; PackageReference: 0402 (1005 Metric); Publisher: Altium Limited; PackageDescription: Chip Resistor, 2-Leads, Body 1.00x0.50mm, IPC Low Density; Supplier Part Number 1: P100KLCT-ND; Supplier 1: Digi-Key; Supplier Link: http://www.digikey.ca/product-search/en?keywords=P100KLCT-ND; Tolerance: ±1%; Operating Temperature: -55°C ~ 155°C
R63 = 13127: RES SMD 0.0OHM JUMPER 1/10W 0402; Part Number: 13127; Manufacturer Part Number: ERJ-2GE0R00X; Designator: R?; Power: 0.1W, 1/10W; PackageDescription: Chip Resistor, 2-Leads, Body 1.00x0.50mm, IPC Low Density; Supplier Part Number 1: P0.0JCT-ND; Supplier 1: Digi-Key; Supplier Link: http://www.digikey.ca/product-search/en?keywords=P0.0JCT-ND; PackageReference: 0402 (1005 Metric); Tolerance: Jumper; Temperature Coefficient: -; Type: Jumper; Operating Temperature: -55°C ~ 155°C; Supplier 2: Mouser; Supplier Part Number 2: 667-ERJ-2GE0R00X
R64 = 18785: RES SMD 110K OHM 1% 1/10W 0402; Part Number: 18785; Manufacturer Part Number: ERJ-2RKF1103X; Designator: R?; Power: 0.1W, 1/10W; Temperature Coefficient: ±100ppm/°C; Published: 8-Jun-2000; LatestRevisionDate: 29-May-2009; LatestRevisionNote: IPC-7351 Footprint Added.; PackageReference: 0402 (1005 Metric); Publisher: Altium Limited; PackageDescription: Chip Resistor, 2-Leads, Body 1.00x0.50mm, IPC Low Density; Supplier Part Number 1: P110KLCT-ND; Supplier 1: Digi-Key; Supplier Link: http://www.digikey.ca/product-search/en?keywords=P110KLCT-ND; Tolerance: ±1%; Operating Temperature: -55°C ~ 155°C
U16 = 145: IC REG BUCK ADJUSTABLE 14A 22SON; Part Number: 145; Designator: U?; Supplier Part Number 2: 595-TPS53319DQPT; Supplier 2: Mouser; Manufacturer Part Number: TPS53319DQPT; Supplier Part Number 1: 296-39410-1-ND; Supplier 1: Digi-Key; Supplier Link: #https://www.digikey.ca/en/products/detail/texas-instruments/TPS53319DQPT/3471186#; PackageReference: TI-R-PSON-N22; Operating Temperature: -40°C ~ 85°C (TA)

## Sheet TPS53319 3.3V Buck Converter.SchDoc
size Letter; Organization: Altium Limited; Address1: L3, 12a Rodborough Rd; Address2: Frenchs Forest; Address3: NSW; Address4: Australia 2086; CopyrightYear: 2019
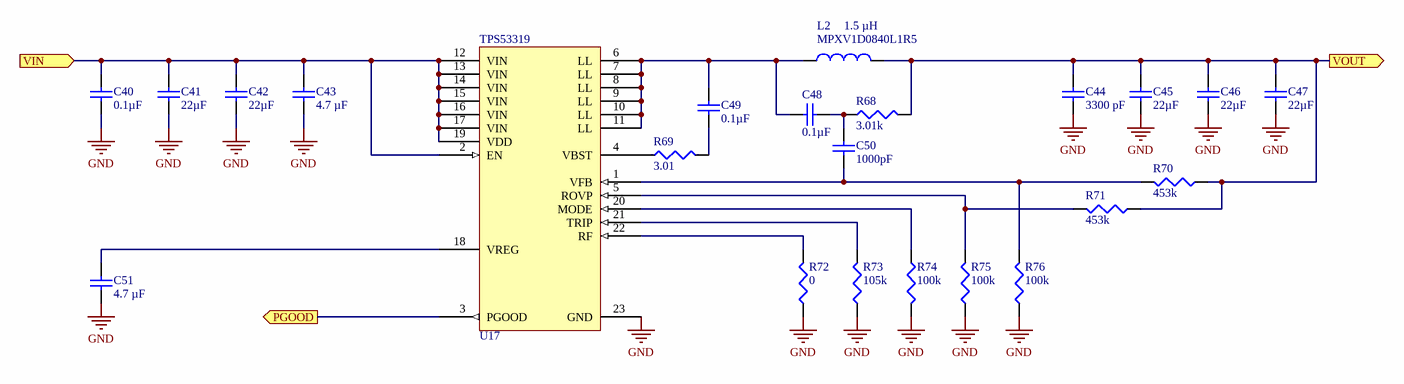
[diagram p9: TPS53319 3.3V Buck Converter.SchDoc]

### Parts
C40  value 0.1µF  [TY-TWK107]  (hidden comment: Cap)
C41  value 22µF  [TDK-C3225]  (hidden comment: Cap)
C42  value 22µF  [TDK-C3225]  (hidden comment: Cap)
C43  value 4.7 µF  [MUR-GRM188]  (hidden comment: Cap)
C44  value 3300 pF  [KEM-0402BB]  (hidden comment: Cap)
C45  value 22µF  [TDK-C3225]  (hidden comment: Cap)
C46  value 22µF  [TDK-C3225]  (hidden comment: Cap)
C47  value 22µF  [TDK-C3225]  (hidden comment: Cap)
C48  value 0.1µF  [TY-TWK107]  (hidden comment: Cap)
C49  value 0.1µF  [TY-TWK107]  (hidden comment: Cap)
C50  value 1000pF  [TDK-CGA2B]  (hidden comment: Cap)
C51  value 4.7 µF  [MUR-GRM188]  (hidden comment: Cap)
L2  value 1.5 µH  Manufacturer Part Number: MPXV1D0840L1R5  [KEM-MPXV1D0840]  (hidden comment: Inductor)
R68  value 3.01k  [VSH-CRCW0201]  (hidden comment: Res3)
R69  value 3.01  [VSH-CRCW0201]  (hidden comment: Res3)
R70  value 453k  [PANA-ERJ2R]  (hidden comment: Res3)
R71  value 453k  [PANA-ERJ2R]  (hidden comment: Res3)
R72  value 0  [PANA-ERJ2G]  (hidden comment: Jumper)
R73  value 105k  [PANA-ERJ2R]  (hidden comment: Res3)
R74  value 100k  [PANA-ERJ2R]  (hidden comment: Res3)
R75  value 100k  [PANA-ERJ2R]  (hidden comment: Res3)
R76  value 100k  [PANA-ERJ2R]  (hidden comment: Res3)
U17  TPS53319  [TI-R-PSON-N22]

### Ports
PGOOD (out), VIN (in), VOUT (out)

### Nets
GND: C40.1 C41.1 C42.1 C43.1 C44.1 C45.1 C46.1 C47.1 C51.1 R72.1 R73.1 R74.1 R75.1 R76.1 U17.23(GND)
VBATT_BUS: C40.2 C41.2 C42.2 C43.2 U17.2(EN) U17.12(VIN) U17.13(VIN) U17.14(VIN) U17.15(VIN) U17.16(VIN) U17.17(VIN) U17.19(VDD) ; port VIN
NetC44_2: C44.2 C45.2 C46.2 C47.2 L2.2 R68.2 R70.1 R71.1 ; port VOUT
NetC48_1: C48.1 C50.1 R68.1
NetC48_2: C48.2 C49.2 L2.1 U17.6(LL) U17.7(LL) U17.8(LL) U17.9(LL) U17.10(LL) U17.11(LL)
NetC49_1: C49.1 R69.2
NetC50_2: C50.2 R70.2 R76.2 U17.1(VFB)
NetC51_2: C51.2 U17.18(VREG)
NetR52_1: U17.3(PGOOD) ; port PGOOD
NetR69_1: R69.1 U17.4(VBST)
NetR71_2: R71.2 R75.2 U17.5(ROVP)
NetR72_2: R72.2 U17.22(RF)
NetR73_2: R73.2 U17.21(TRIP)
NetR74_2: R74.2 U17.20(MODE)

### Notes on the sheet
- (the "License"); you may not use or redistribute this file except in compliance with the License. You
- This file and the information within it are licensed under the terms of the Apache License, Version 2.0
- Copyright
- Unless required by applicable law or agreed to in writing, content distributed under the License is
- distributed on an "AS IS" BASIS, WITHOUT WARRANTIES OR CONDITIONS OF ANY KIND,
- either express or implied. See the License for the specific language governing permissions and
- limitations under the License.
- may obtain a copy of the License at:
- http://www.apache.org/licenses/LICENSE-2.0
- Title
- Size:
- Date:
- Letter
- Number:
- Time:
- Revision:
- Sheet
- of
- University of Alberta
- Deptartment of Electrical
- and Computer Engineering
- Edmonton AB, Canada
- T6G 1H9
- File:

### Library data of the parts
C40 C48 C49 = PC-TY-00817: CAP CER 0.1UF 25V X7R 0306; Manufacturer Part Number: TWK107B7104MVHT; Index: 817; Designator: C?; Tolerance: ±20%; Published: 2022-12-10; LatestRevisionDate: 2022-12-10; LatestRevisionNote: ...; PackageReference: 0306 (0816 Metric); Publisher: AlbertaSat; PackageDescription: Chip Capacitor, 2-Leads, Body 0.80x1.60mm, IPC Low Density; Part Number: PC-TY-00817; Supplier Part Number 1: 587-6181-1-ND; Supplier 1: Digi-key; Supplier Part Number 2: 963-TWK107B7104MVHT; Supplier 2: Mouser; Supplier Link: #https://www.digikey.ca/en/products/detail/taiyo-yuden/TWK107B7104MVHT/7403736#; Voltage-Rated: 25V; Temperature Coefficient: X7R; Application: Automotive; Operating Temperature: -55°C ~ 125°C
C41 C42 C45-C47 = PC-TDK-02965: CAP CER 22UF 25V X7R 1210; Manufacturer Part Number: C3225X7R1E226M250AB; Index: 2965; Designator: C?; Tolerance: ±20%; Code_IEC: 3225; Published: 2022-10-26; LatestRevisionDate: 2022-10-26; LatestRevisionNote: ...; PackageReference: 1210 (3225 Metric); Publisher: AlbertaSat; PackageDescription: Chip Capacitor, 2-Leads, Body 3.20x2.50mm, IPC Low Density; Part Number: PC-TDK-02965; Supplier Part Number 1: 445-181602-1-ND; Supplier 1: Digi-key; Supplier Part Number 2: 810-C3225X7R1EM250AB; Supplier 2: Mouser; Supplier Link: #https://www.digikey.ca/en/products/detail/tdk-corporation/C3225X7R1E226M250AB/9991387#; Voltage - Rated: 25V; Temperature Coefficient: X7R; Applications: General Purpose; Code_JEITA: 1210; Operating Temperature: -55°C ~ 125°C
C43 C51 = 10165: CAP CER 4.7UF 16V X7R 0603; Part Number: 10165; Manufacturer Part Number: GRM188Z71C475KE21D; Designator: C?; Tolerance: ±10%; Voltage - Rated: 25V; Published: 8-Jun-2000; LatestRevisionDate: 17-Jul-2002; LatestRevisionNote: Re-released for DXP Platform.; PackageReference: 0603 (1608 Metric); Publisher: Altium Limited; PackageDescription: Chip Capacitor, 2-Leads, Body 1.60x0.80mm, IPC Low Density; Supplier Part Number 1: 490-GRM188Z71C475KE21DCT-ND; Supplier 1: Digi-Key; Supplier Link: #https://www.digikey.ca/en/products/detail/murata-electronics/GRM188Z71C475KE21D/13401930#; Temperature Coefficient: X7R; Application: General Purpose; Operating Temperature: -55°C ~ 125°C; Supplier 2: Mouser; Supplier Part Number 2: 81-GRM188Z71C475KE1D
C44 = PC-KEM-03166: CAP CER 3300PF 50V X7R 0402; Manufacturer Part Number: C0402C332K5RAC7867; Index: 3166; Designator: C?; Tolerance: ±10%; Published: 2022-10-26; LatestRevisionDate: 2023-05-04; LatestRevisionNote: Added operating temperature; PackageReference: 0402 (1005 Metric); Publisher: AlbertaSat; PackageDescription: Chip Capacitor, 2-Leads, Body 1.00x0.50mm, IPC Low Density; Part Number: PC-KEM-03166; Supplier Part Number 1: 399-C0402C332K5RAC7867CT-ND; Supplier 1: Digi-key; Supplier Part Number 2: 80-C0402C332K5RAC; Supplier 2: Mouser; Supplier Link: #https://www.digikey.ca/en/products/detail/kemet/C0402C332K5RAC7867/501972?s=N4IgTCBcDaIMwE4EFoDCAGALOsq5zAGkBWAJQEFUB2ADgDYrUAVZAOQBEQBdAXyA#; Voltage - Rated: 50V; Temperature Coefficient: X7R; Applications: Bypass, Decoupling; Operating Temperature: -55°C ~ 125°C
C50 = PC-TDK-01454: CAP CER 1000PF 100V C0G 0402; Manufacturer Part Number: CGA2B1C0G2A102J050BC; Index: 1454; Designator: C?; Tolerance: ±5%; Temperature Coefficient: NP0; Published: 2016-03-16; LatestRevisionDate: 2016-03-16; LatestRevisionNote: ...; PackageReference: 0402 (1005 Metric); Publisher: AlbertaSat; PackageDescription: Radial Cap, Thru-Hole; 2 Leads; 0.3 in Pin Spacing; Part Number: PC-TDK-01454; Supplier Part Number 1: 445-172682-1-ND; Supplier 1: Digi-key; Supplier Link: http://www.digikey.ca/product-search/en?keywords=445-172682-1-ND; Voltage - Rated: 100V; Applications: Automotive; Operating Temperature: -55°C ~ 125°C
L2 = PL-KEM-03165: FIXED IND 1.5UH 16.2A 6.8MOHM SM; Code_IEC: 1005; Index: 3165; Designator: L?; Tolerance: ±20%; Published: 2022-10-26; LatestRevisionDate: 2023-05-04; LatestRevisionNote: Added operating temperature; PackageReference: 0.341" L x 0.315" W (8.65mm x 8.00mm); Publisher: AlbertaSat; PackageDescription: Precision Wire Wound Inductor, 2-Leads, Body 8.65x8.00mm, IPC Low Density; Code_JEITA: 0402; Part Number: PL-KEM-03165; Supplier Part Number 1: 399-MPXV1D0840L1R5CT-ND; Supplier 1: Digi-key; Supplier Part Number 2: 80-MPXV1D0840L1R5; Supplier 2: Mouser; Supplier Link: #https://www.digikey.ca/en/products/detail/kemet/MPXV1D0840L1R5/11314594?s=N4IgTCBcDaILIAUAaA1AjAEQAwA4AsWAMmgEoCsIAugL5A#; Operating Temperature: -55°C ~ 155°C
R68 = PR-VSH-00325: RES SMD 3.01K OHM 1% 1/20W 0201; Manufacturer Part Number: CRCW02013K01FKED; Index: 325; Designator: R?; Power - Rated: 0.05W, 1/20W; Temperature Coefficient: ±100ppm/°C; Published: 2022-12-11; LatestRevisionDate: 2022-12-11; LatestRevisionNote: ...; PackageReference: 0201 (0603 Metric); Publisher: AlbertaSat; PackageDescription: Chip Resistor, 2-Leads, Body 0.60x0.30mm, IPC Low Density; Part Number: PR-VSH-00325; Supplier Part Number 1: 541-3.01KAABCT-ND; Supplier 1: Digi-key; Supplier Part Number 2: 71-CRCW02013K01FKED; Supplier 2: Mouser; Supplier Link: #https://www.digikey.ca/en/products/detail/vishay-dale/CRCW02013K01FKED/1968056#; Tolerance: ±1%; Operating Temperature: -55°C ~ 155°C
R69 = PR-VSH-00326: CRCW0201 - 200/+400 3R01 1% ET7; Manufacturer Part Number: CRCW02013R01FXED; Index: 326; Designator: R?; Power - Rated: 0.05W, 1/20W; Temperature Coefficient: -200/ +400ppm/°C; Published: 2022-12-11; LatestRevisionDate: 2022-12-11; LatestRevisionNote: ...; PackageReference: 0201 (0603 Metric); Publisher: AlbertaSat; PackageDescription: Chip Resistor, 2-Leads, Body 0.60x0.30mm, IPC Low Density; Part Number: PR-VSH-00326; Supplier Part Number 1: 541-CRCW02013R01FXEDCT-ND; Supplier 1: Digi-key; Supplier Part Number 2: CRCW02013R01FXED; Supplier 2: Avnet; Supplier Link: #https://www.digikey.ca/en/products/detail/vishay-dale/CRCW02013R01FXED/10458991#; Tolerance: ±1%; Operating Temperature: -55°C ~ 155°C
R70 R71 = 19391: RES SMD 453K OHM 1% 1/10W 0402; Part Number: 19391; Manufacturer Part Number: ERJ-2RKF4533X; Designator: R?; Power: 0.1W, 1/10W; Temperature Coefficient: ±100ppm/°C; Published: 8-Jun-2000; LatestRevisionDate: 29-May-2009; LatestRevisionNote: IPC-7351 Footprint Added.; PackageReference: 0402 (1005 Metric); Publisher: Altium Limited; PackageDescription: Chip Resistor, 2-Leads, Body 1.00x0.50mm, IPC Low Density; Supplier Part Number 1: P453KLCT-ND; Supplier 1: Digi-Key; Supplier Link: http://www.digikey.ca/product-search/en?keywords=P453KLCT-ND; Tolerance: ±1%; Operating Temperature: -55°C ~ 155°C
R72 = 13127: RES SMD 0.0OHM JUMPER 1/10W 0402; Part Number: 13127; Manufacturer Part Number: ERJ-2GE0R00X; Designator: R?; Power: 0.1W, 1/10W; PackageDescription: Chip Resistor, 2-Leads, Body 1.00x0.50mm, IPC Low Density; Supplier Part Number 1: P0.0JCT-ND; Supplier 1: Digi-Key; Supplier Link: http://www.digikey.ca/product-search/en?keywords=P0.0JCT-ND; PackageReference: 0402 (1005 Metric); Tolerance: Jumper; Temperature Coefficient: -; Type: Jumper; Operating Temperature: -55°C ~ 155°C; Supplier 2: Mouser; Supplier Part Number 2: 667-ERJ-2GE0R00X
R73 = 18767: RES SMD 105K OHM 1% 1/10W 0402; Part Number: 18767; Manufacturer Part Number: ERJ-2RKF1053X; Designator: R?; Power: 0.1W, 1/10W; Temperature Coefficient: ±100ppm/°C; Published: 8-Jun-2000; LatestRevisionDate: 29-May-2009; LatestRevisionNote: IPC-7351 Footprint Added.; PackageReference: 0402 (1005 Metric); Publisher: Altium Limited; PackageDescription: Chip Resistor, 2-Leads, Body 1.00x0.50mm, IPC Low Density; Supplier Part Number 1: P105KLCT-ND; Supplier 1: Digi-Key; Supplier Link: http://www.digikey.ca/product-search/en?keywords=P105KLCT-ND; Tolerance: ±1%; Operating Temperature: -55°C ~ 155°C
R74-R76 = 18739: RES SMD 100K OHM 1% 1/10W 0402; Part Number: 18739; Manufacturer Part Number: ERJ-2RKF1003X; Designator: R?; Power: 0.1W, 1/10W; Temperature Coefficient: ±100ppm/°C; Published: 8-Jun-2000; LatestRevisionDate: 29-May-2009; LatestRevisionNote: IPC-7351 Footprint Added.; PackageReference: 0402 (1005 Metric); Publisher: Altium Limited; PackageDescription: Chip Resistor, 2-Leads, Body 1.00x0.50mm, IPC Low Density; Supplier Part Number 1: P100KLCT-ND; Supplier 1: Digi-Key; Supplier Link: http://www.digikey.ca/product-search/en?keywords=P100KLCT-ND; Tolerance: ±1%; Operating Temperature: -55°C ~ 155°C
U17 = 145: IC REG BUCK ADJUSTABLE 14A 22SON; Part Number: 145; Designator: U?; Supplier Part Number 2: 595-TPS53319DQPT; Supplier 2: Mouser; Manufacturer Part Number: TPS53319DQPT; Supplier Part Number 1: 296-39410-1-ND; Supplier 1: Digi-Key; Supplier Link: #https://www.digikey.ca/en/products/detail/texas-instruments/TPS53319DQPT/3471186#; PackageReference: TI-R-PSON-N22; Operating Temperature: -40°C ~ 85°C (TA)